# Altium schematic sheet Plugs.SchDoc
size A4
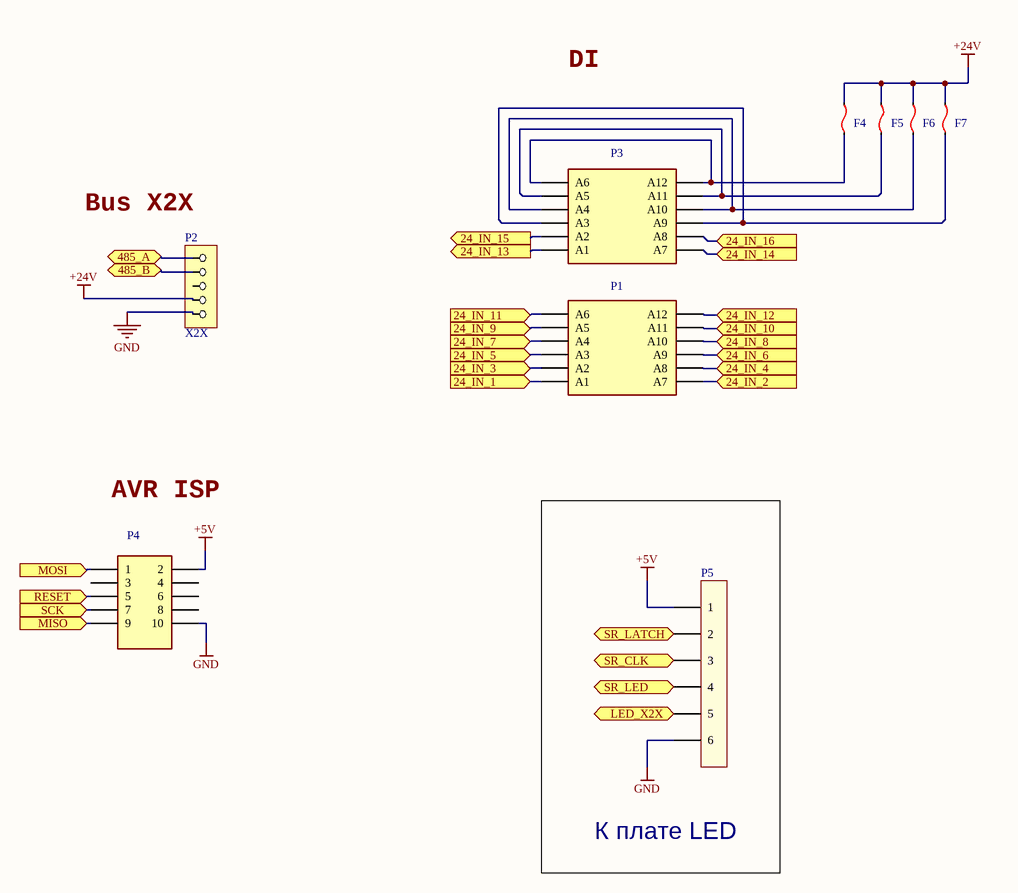
[diagram p0: Plugs.SchDoc]

## Parts
F4  Fuse PTS  [1210_MF]  (value not drawn)
F5  Fuse PTS  [1210_MF]  (value not drawn)
F6  Fuse PTS  [1210_MF]  (value not drawn)
F7  Fuse PTS  [1210_MF]  (value not drawn)
P1  MCD 1.5/6 Phoenix  [mcd 1,5/6-G1-3.81]  (value not drawn)
P2  X2X  [MSTBA 1757271]
P3  (no value)  [mcd 1,5/6-G1-3.81]
P4  (no value)  [IDC-10MS]
P5  (no value)  [PLS-6 2.54]

## Blocks framed on the sheet
К плате LED: P5

## Ports
24_IN_1, 24_IN_2, 24_IN_3, 24_IN_4, 24_IN_5, 24_IN_6, 24_IN_7, 24_IN_8, 24_IN_9, 24_IN_10, 24_IN_11, 24_IN_12, 24_IN_13, 24_IN_14, 24_IN_15, 24_IN_16, 485_A, 485_B, LED_X2X, MISO, MOSI, RESET, SCK, SR_CLK, SR_LATCH, SR_LED

## Nets
+5V: P4.2 P5.1
+24V: F4.1 F5.1 F6.1 F7.1 P2.4
GND: P2.5 P4.10 P5.6
24_IN_1: P1.11(A1) ; port 24_IN_1
24_IN_2: P1.12(A7) ; port 24_IN_2
24_IN_3: P1.9(A2) ; port 24_IN_3
24_IN_4: P1.10(A8) ; port 24_IN_4
24_IN_5: P1.7(A3) ; port 24_IN_5
24_IN_6: P1.8(A9) ; port 24_IN_6
24_IN_7: P1.5(A4) ; port 24_IN_7
24_IN_8: P1.6(A10) ; port 24_IN_8
24_IN_9: P1.3(A5) ; port 24_IN_9
24_IN_10: P1.4(A11) ; port 24_IN_10
24_IN_11: P1.1(A6) ; port 24_IN_11
24_IN_12: P1.2(A12) ; port 24_IN_12
24_IN_13: P3.11(A1) ; port 24_IN_13
24_IN_14: P3.12(A7) ; port 24_IN_14
24_IN_15: P3.9(A2) ; port 24_IN_15
24_IN_16: P3.10(A8) ; port 24_IN_16
485_A: P2.1 ; port 485_A
485_B: P2.2 ; port 485_B
LED_X2X: P5.5 ; port LED_X2X
MISO: P4.9 ; port MISO
MOSI: P4.1 ; port MOSI
RESET: P4.5 ; port RESET
SCK: P4.7 ; port SCK
SR_CLK: P5.3 ; port SR_CLK
SR_LATCH: P5.2 ; port SR_LATCH
SR_LED: P5.4 ; port SR_LED
NetF4_2: F4.2 P3.1(A6) P3.2(A12)
NetF5_2: F5.2 P3.3(A5) P3.4(A11)
NetF6_2: F6.2 P3.5(A4) P3.6(A10)
NetF7_2: F7.2 P3.7(A3) P3.8(A9)

Not connected (* = marked no-connect by the designer): P2 3; P4 3 4 6 8

## Notes on the sheet
- DI
- (near P2) Bus X2X
- AVR ISP

## Library data of the parts
F4-F7 = MSMF: Part Description: PPTC 60V 100MA; Part Number: MF-MSMF010-2
P2 = EMSTBA 2.5/5-G-5.08: Part Number: EMSTBA 2.5/5-G-5.08
P3 = MCD 1.5/6 Phoenix: Part Number: MCD 1.5/6 Phoenix
P4 = IDC-10MS: Part Number: DS1013-10SSIB1-B-0
P5 = PLS-6: Part Number: PLS-6
P1 = MCD 1.5/6 Phoenix: Part Number: MCD 1.5/6 Phoenix